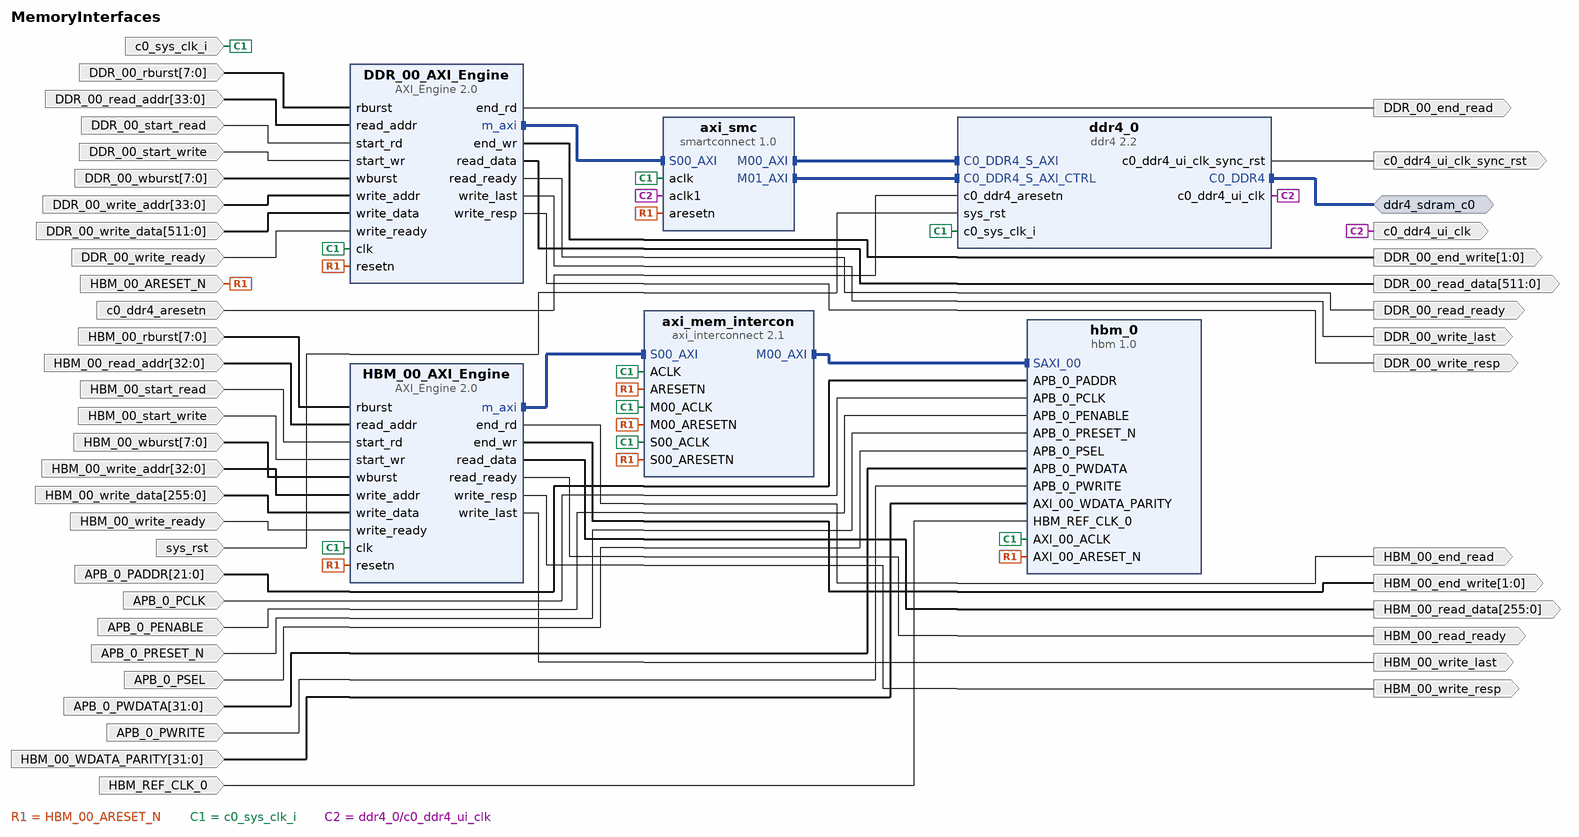
[diagram p0: block diagram of the top level]
# Vivado block design MemoryInterfaces, xcu280-fsvh2892-2L-e, Vivado 2022.1
create_bd_design MemoryInterfaces

create_bd_intf_port -mode Master -vlnv xilinx.com:interface:ddr4_rtl:1.0 ddr4_sdram_c0
create_bd_port -dir I -type clk HBM_REF_CLK_0
set_property -dict {CONFIG.FREQ_HZ 100000000} [get_bd_ports HBM_REF_CLK_0]
create_bd_port -dir I -type rst HBM_00_ARESET_N
create_bd_port -dir I -from 31 -to 0 HBM_00_WDATA_PARITY
create_bd_port -dir I -from 21 -to 0 APB_0_PADDR
create_bd_port -dir I -from 31 -to 0 APB_0_PWDATA
create_bd_port -dir I APB_0_PWRITE
create_bd_port -dir I APB_0_PCLK
create_bd_port -dir I APB_0_PRESET_N
create_bd_port -dir I APB_0_PENABLE
create_bd_port -dir I APB_0_PSEL
create_bd_port -dir I HBM_00_start_write
create_bd_port -dir I HBM_00_start_read
create_bd_port -dir I -from 7 -to 0 HBM_00_wburst
create_bd_port -dir I -from 7 -to 0 HBM_00_rburst
create_bd_port -dir I HBM_00_write_ready
create_bd_port -dir I -from 32 -to 0 HBM_00_write_addr
create_bd_port -dir I -from 32 -to 0 HBM_00_read_addr
create_bd_port -dir O -from 1 -to 0 HBM_00_end_write
create_bd_port -dir O HBM_00_read_ready
create_bd_port -dir O HBM_00_write_resp
create_bd_port -dir I -from 255 -to 0 -type data HBM_00_write_data
create_bd_port -dir O -from 255 -to 0 -type data HBM_00_read_data
create_bd_port -dir O HBM_00_end_read
create_bd_port -dir I -type rst c0_ddr4_aresetn
create_bd_port -dir I -type rst sys_rst
set_property -dict {CONFIG.POLARITY ACTIVE_HIGH} [get_bd_ports sys_rst]
create_bd_port -dir I -type clk c0_sys_clk_i
set_property -dict {CONFIG.ASSOCIATED_RESET HBM_00_ARESET_N CONFIG.FREQ_HZ 300000000} [get_bd_ports c0_sys_clk_i]
create_bd_port -dir O -type rst c0_ddr4_ui_clk_sync_rst
create_bd_port -dir I DDR_00_start_write
create_bd_port -dir I DDR_00_start_read
create_bd_port -dir I -from 33 -to 0 DDR_00_write_addr
create_bd_port -dir I -from 33 -to 0 DDR_00_read_addr
create_bd_port -dir I -from 7 -to 0 DDR_00_rburst
create_bd_port -dir I -from 7 -to 0 DDR_00_wburst
create_bd_port -dir I DDR_00_write_ready
create_bd_port -dir O DDR_00_write_resp
create_bd_port -dir O DDR_00_read_ready
create_bd_port -dir O DDR_00_end_read
create_bd_port -dir O -from 1 -to 0 DDR_00_end_write
create_bd_port -dir I -from 511 -to 0 -type data DDR_00_write_data
create_bd_port -dir O -from 511 -to 0 -type data DDR_00_read_data
create_bd_port -dir O -type clk c0_ddr4_ui_clk
set_property -dict {CONFIG.ASSOCIATED_RESET c0_ddr4_aresetn} [get_bd_ports c0_ddr4_ui_clk]
create_bd_port -dir O DDR_00_write_last
create_bd_port -dir O HBM_00_write_last

create_bd_cell -type ip -vlnv xilinx.com:ip:hbm:1.0 hbm_0
set_property -dict [list \
  CONFIG.USER_AXI_INPUT_CLK_FREQ 300 \
  CONFIG.USER_AXI_INPUT_CLK_NS 3.333 \
  CONFIG.USER_AXI_INPUT_CLK_PS 3333 \
  CONFIG.USER_AXI_INPUT_CLK_XDC 3.333 \
  CONFIG.USER_MC_ENABLE_01 FALSE \
  CONFIG.USER_MC_ENABLE_02 FALSE \
  CONFIG.USER_MC_ENABLE_03 FALSE \
  CONFIG.USER_MC_ENABLE_04 FALSE \
  CONFIG.USER_MC_ENABLE_05 FALSE \
  CONFIG.USER_MC_ENABLE_06 FALSE \
  CONFIG.USER_MC_ENABLE_07 FALSE \
  CONFIG.USER_SAXI_01 false \
  CONFIG.USER_SWITCH_ENABLE_00 FALSE \
] [get_bd_cells hbm_0]
create_bd_cell -type ip -vlnv xilinx.com:ip:ddr4:2.2 ddr4_0
set_property -dict [list \
  CONFIG.ADDN_UI_CLKOUT1_FREQ_HZ None \
  CONFIG.C0.DDR4_DIVCLK_DIVIDE 3 \
  CONFIG.C0.DDR4_Specify_MandD true \
  CONFIG.C0_CLOCK_BOARD_INTERFACE Custom \
  CONFIG.C0_DDR4_BOARD_INTERFACE ddr4_sdram_c0 \
  CONFIG.System_Clock No_Buffer \
] [get_bd_cells ddr4_0]
create_bd_cell -type ip -vlnv xilinx.com:ip:axi_interconnect:2.1 axi_mem_intercon
set_property -dict {CONFIG.NUM_MI 1} [get_bd_cells axi_mem_intercon]
create_bd_cell -type ip -vlnv xilinx.com:ip:smartconnect:1.0 axi_smc
set_property -dict {CONFIG.NUM_CLKS 2 CONFIG.NUM_MI 2 CONFIG.NUM_SI 1} [get_bd_cells axi_smc]
create_bd_cell -type ip -vlnv user.org:user:AXI_Engine:2.0 HBM_00_AXI_Engine
create_bd_cell -type ip -vlnv user.org:user:AXI_Engine:2.0 DDR_00_AXI_Engine
set_property -dict {CONFIG.ADDR_WIDTH 34 CONFIG.DATA_WIDTH 512} [get_bd_cells DDR_00_AXI_Engine]

# ---- connections ----

connect_bd_intf_net [get_bd_intf_pins DDR_00_AXI_Engine/m_axi] [get_bd_intf_pins axi_smc/S00_AXI]
connect_bd_intf_net [get_bd_intf_pins HBM_00_AXI_Engine/m_axi] [get_bd_intf_pins axi_mem_intercon/S00_AXI]
connect_bd_intf_net [get_bd_intf_pins axi_mem_intercon/M00_AXI] [get_bd_intf_pins hbm_0/SAXI_00]
connect_bd_intf_net [get_bd_intf_pins axi_smc/M00_AXI] [get_bd_intf_pins ddr4_0/C0_DDR4_S_AXI]
connect_bd_intf_net [get_bd_intf_pins axi_smc/M01_AXI] [get_bd_intf_pins ddr4_0/C0_DDR4_S_AXI_CTRL]
connect_bd_intf_net [get_bd_intf_ports ddr4_sdram_c0] [get_bd_intf_pins ddr4_0/C0_DDR4]
connect_bd_net [get_bd_ports APB_0_PADDR] [get_bd_pins hbm_0/APB_0_PADDR]
connect_bd_net [get_bd_ports APB_0_PCLK] [get_bd_pins hbm_0/APB_0_PCLK]
connect_bd_net [get_bd_ports APB_0_PENABLE] [get_bd_pins hbm_0/APB_0_PENABLE]
connect_bd_net [get_bd_ports APB_0_PRESET_N] [get_bd_pins hbm_0/APB_0_PRESET_N]
connect_bd_net [get_bd_ports APB_0_PSEL] [get_bd_pins hbm_0/APB_0_PSEL]
connect_bd_net [get_bd_ports APB_0_PWDATA] [get_bd_pins hbm_0/APB_0_PWDATA]
connect_bd_net [get_bd_ports APB_0_PWRITE] [get_bd_pins hbm_0/APB_0_PWRITE]
connect_bd_net -net AXI_00_ARESET_N_1 [get_bd_ports HBM_00_ARESET_N] \
  [get_bd_pins hbm_0/AXI_00_ARESET_N] [get_bd_pins axi_mem_intercon/S00_ARESETN] [get_bd_pins axi_mem_intercon/M00_ARESETN] \
  [get_bd_pins axi_mem_intercon/ARESETN] [get_bd_pins axi_smc/aresetn] [get_bd_pins HBM_00_AXI_Engine/resetn] \
  [get_bd_pins DDR_00_AXI_Engine/resetn]
connect_bd_net -net AXI_00_WDATA_PARITY_1 [get_bd_ports HBM_00_WDATA_PARITY] [get_bd_pins hbm_0/AXI_00_WDATA_PARITY]
connect_bd_net -net AXI_Engine_0_end_rd [get_bd_pins HBM_00_AXI_Engine/end_rd] [get_bd_ports HBM_00_end_read]
connect_bd_net -net AXI_Engine_0_end_wr [get_bd_pins HBM_00_AXI_Engine/end_wr] [get_bd_ports HBM_00_end_write]
connect_bd_net -net AXI_Engine_0_read_data [get_bd_pins HBM_00_AXI_Engine/read_data] [get_bd_ports HBM_00_read_data]
connect_bd_net -net AXI_Engine_0_read_ready [get_bd_pins HBM_00_AXI_Engine/read_ready] [get_bd_ports HBM_00_read_ready]
connect_bd_net -net AXI_Engine_0_write_resp [get_bd_pins HBM_00_AXI_Engine/write_resp] [get_bd_ports HBM_00_write_resp]
connect_bd_net [get_bd_pins DDR_00_AXI_Engine/end_rd] [get_bd_ports DDR_00_end_read]
connect_bd_net [get_bd_pins DDR_00_AXI_Engine/end_wr] [get_bd_ports DDR_00_end_write]
connect_bd_net [get_bd_pins DDR_00_AXI_Engine/read_data] [get_bd_ports DDR_00_read_data]
connect_bd_net [get_bd_pins DDR_00_AXI_Engine/read_ready] [get_bd_ports DDR_00_read_ready]
connect_bd_net [get_bd_pins DDR_00_AXI_Engine/write_last] [get_bd_ports DDR_00_write_last]
connect_bd_net [get_bd_pins DDR_00_AXI_Engine/write_resp] [get_bd_ports DDR_00_write_resp]
connect_bd_net [get_bd_ports DDR_00_rburst] [get_bd_pins DDR_00_AXI_Engine/rburst]
connect_bd_net [get_bd_ports DDR_00_read_addr] [get_bd_pins DDR_00_AXI_Engine/read_addr]
connect_bd_net [get_bd_ports DDR_00_start_read] [get_bd_pins DDR_00_AXI_Engine/start_rd]
connect_bd_net [get_bd_ports DDR_00_start_write] [get_bd_pins DDR_00_AXI_Engine/start_wr]
connect_bd_net [get_bd_ports DDR_00_wburst] [get_bd_pins DDR_00_AXI_Engine/wburst]
connect_bd_net [get_bd_ports DDR_00_write_addr] [get_bd_pins DDR_00_AXI_Engine/write_addr]
connect_bd_net [get_bd_ports DDR_00_write_data] [get_bd_pins DDR_00_AXI_Engine/write_data]
connect_bd_net [get_bd_ports DDR_00_write_ready] [get_bd_pins DDR_00_AXI_Engine/write_ready]
connect_bd_net [get_bd_pins HBM_00_AXI_Engine/write_last] [get_bd_ports HBM_00_write_last]
connect_bd_net [get_bd_ports HBM_00_rburst] [get_bd_pins HBM_00_AXI_Engine/rburst]
connect_bd_net [get_bd_ports HBM_00_read_addr] [get_bd_pins HBM_00_AXI_Engine/read_addr]
connect_bd_net [get_bd_ports HBM_00_start_read] [get_bd_pins HBM_00_AXI_Engine/start_rd]
connect_bd_net [get_bd_ports HBM_00_start_write] [get_bd_pins HBM_00_AXI_Engine/start_wr]
connect_bd_net [get_bd_ports HBM_00_wburst] [get_bd_pins HBM_00_AXI_Engine/wburst]
connect_bd_net [get_bd_ports HBM_00_write_addr] [get_bd_pins HBM_00_AXI_Engine/write_addr]
connect_bd_net [get_bd_ports HBM_00_write_data] [get_bd_pins HBM_00_AXI_Engine/write_data]
connect_bd_net [get_bd_ports HBM_00_write_ready] [get_bd_pins HBM_00_AXI_Engine/write_ready]
connect_bd_net -net HBM_REF_CLK_0_1 [get_bd_ports HBM_REF_CLK_0] [get_bd_pins hbm_0/HBM_REF_CLK_0]
connect_bd_net [get_bd_ports c0_ddr4_aresetn] [get_bd_pins ddr4_0/c0_ddr4_aresetn]
connect_bd_net [get_bd_ports c0_sys_clk_i] \
  [get_bd_pins ddr4_0/c0_sys_clk_i] [get_bd_pins hbm_0/AXI_00_ACLK] [get_bd_pins axi_mem_intercon/ACLK] \
  [get_bd_pins axi_mem_intercon/S00_ACLK] [get_bd_pins axi_mem_intercon/M00_ACLK] [get_bd_pins axi_smc/aclk] \
  [get_bd_pins HBM_00_AXI_Engine/clk] [get_bd_pins DDR_00_AXI_Engine/clk]
connect_bd_net [get_bd_pins ddr4_0/c0_ddr4_ui_clk] [get_bd_pins axi_smc/aclk1] [get_bd_ports c0_ddr4_ui_clk]
connect_bd_net [get_bd_pins ddr4_0/c0_ddr4_ui_clk_sync_rst] [get_bd_ports c0_ddr4_ui_clk_sync_rst]
connect_bd_net [get_bd_ports sys_rst] [get_bd_pins ddr4_0/sys_rst]

# ---- address map ----
assign_bd_address -offset 0x000000000 -range 8G -target_address_space [get_bd_addr_spaces DDR_00_AXI_Engine/m_axi] [get_bd_addr_segs ddr4_0/C0_DDR4_MEMORY_MAP/C0_DDR4_ADDRESS_BLOCK]
assign_bd_address -offset 0x200000000 -range 1M -target_address_space [get_bd_addr_spaces DDR_00_AXI_Engine/m_axi] [get_bd_addr_segs ddr4_0/C0_DDR4_MEMORY_MAP_CTRL/C0_REG]
assign_bd_address -offset 0x000000000 -range 256M -target_address_space [get_bd_addr_spaces HBM_00_AXI_Engine/m_axi] [get_bd_addr_segs hbm_0/SAXI_00/HBM_MEM00]

validate_bd_design
save_bd_design
